# EasyEDA Pro project 射级跟随器.eprj

# Schematic Schematic1
Board Name: Board1; Create Date: 2025-05-12; Page Name: P1; Project Name: 射极跟随器; Schematic Name: Schematic1; Update Date: 2025-05-12; Company: 嘉立创EDA; Page Size: A4; Version: V1.0
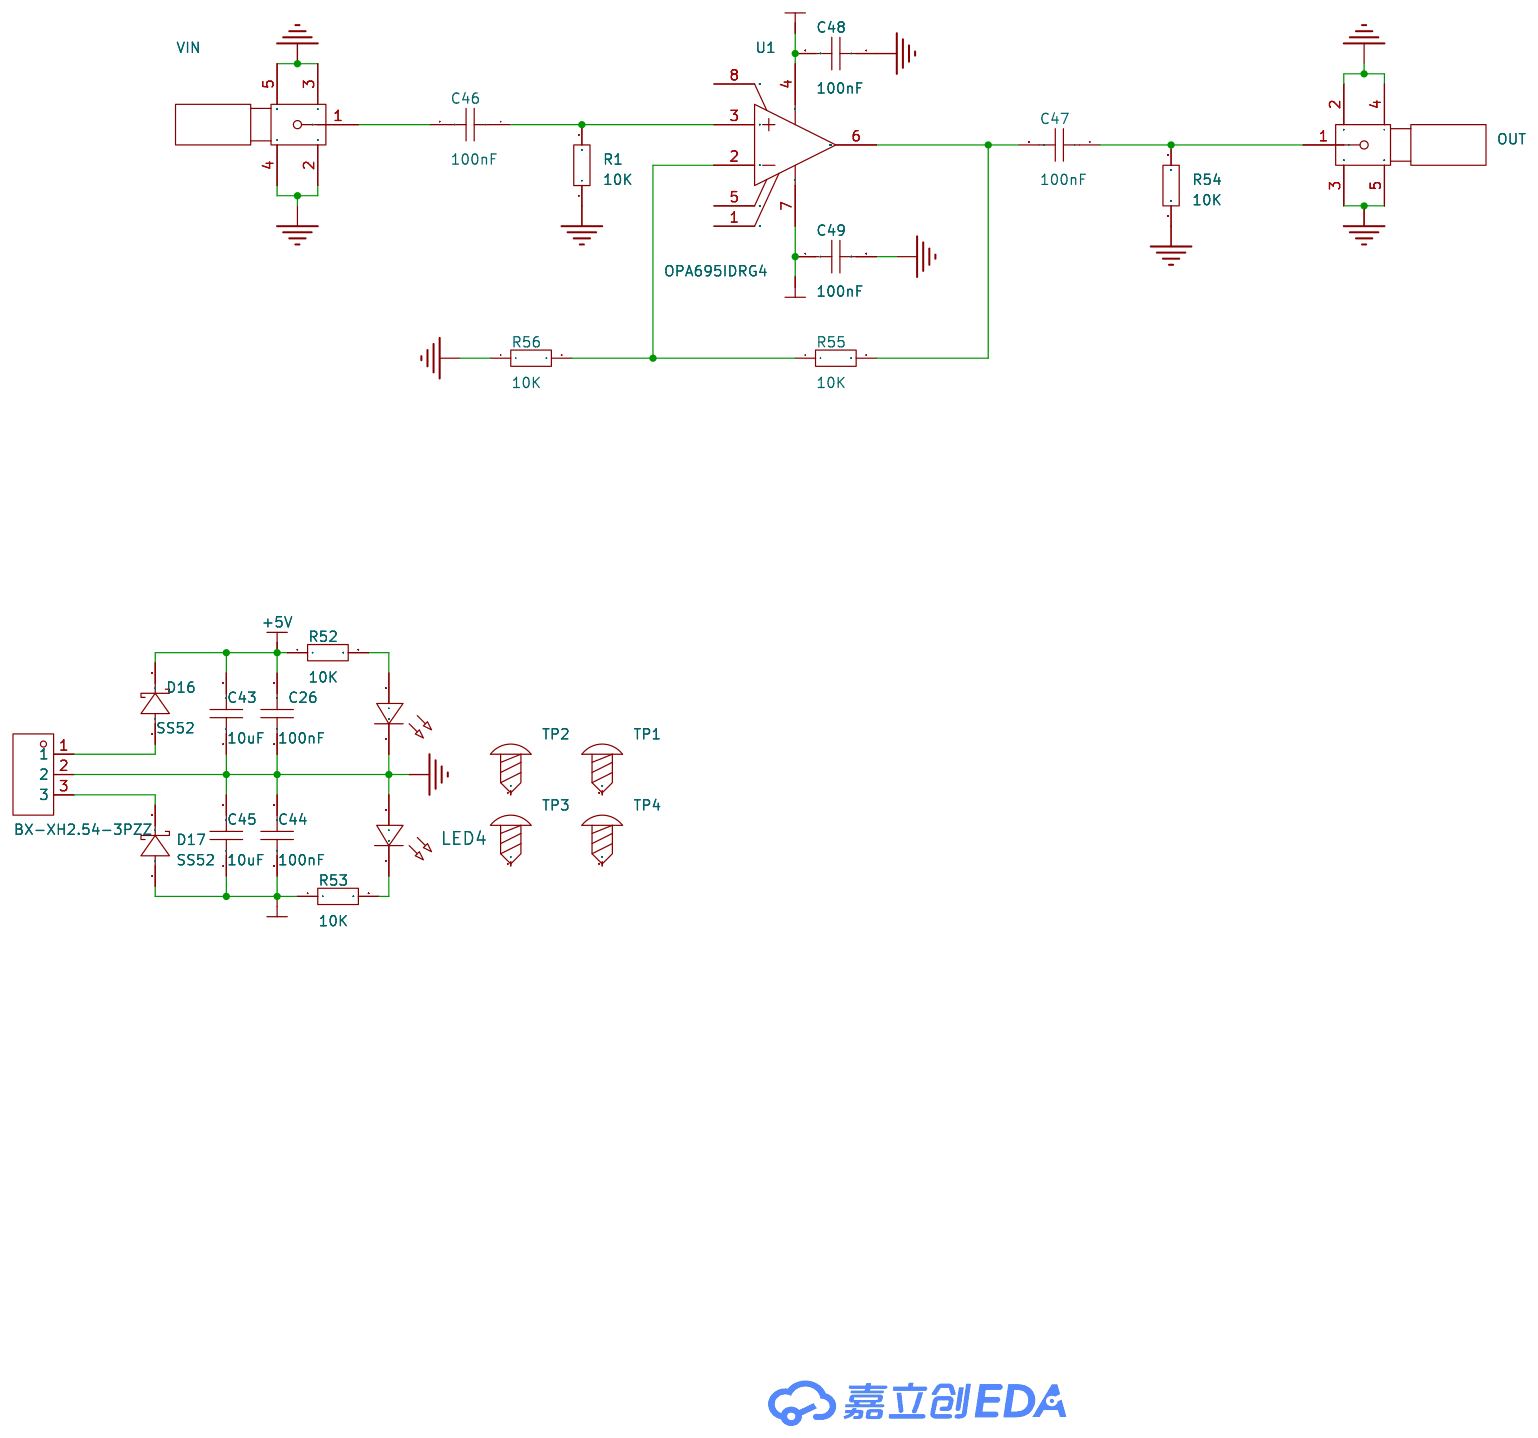
[diagram p0: schematic sheet]

## Parts
C26  100nF  [C0603]
C43  10uF  [C0603]
C44  100nF  [C0603]
C45  10uF  [C0603]
C46  100nF  [C0603]
C47  100nF  [C0603]
C48  100nF  [C0603]
C49  100nF  [C0603]
D16  SS52  [SMA_L4.3-W2.6-LS5.1-R-RD]
D17  SS52  [SMA_L4.3-W2.6-LS5.1-R-RD]
LED3  -  [LED_0603]
LED4  -  [LED_0603]
OUT  被测信号  [SMA-SMD_SMA-KE]
R1  10K  [R0603]
R52  10K  [R0603]
R53  10K  [R0603]
R54  10K  [R0603]
R55  10K  [R0603]
R56  10K  [R0603]
TP1  -  [M2螺丝]
TP2  -  [M2螺丝]
TP3  -  [M2螺丝]
TP4  -  [M2螺丝]
U1  OPA695IDRG4  [SOIC-8_L5.0-W4.0-P1.27-LS6.1-BL]
U2  BX-XH2.54-3PZZ  [CONN-TH_3P-P2.50_BX-XH2.54-3PZZ]
VIN  被测信号  [SMA-SMD_SMA-KE]

## Library data of the parts
C26 C43-C49 = CAP_0603: Supplier Footprint: 0603
D16 D17 = SS52: 二极管配置:独立式;正向压降(Vf):550mV@5A;直流反向耐压(Vr):20V;平均整流电流(Io):5A;; LCSC Part Name: 电压:20V 电流:5A; Supplier Part: C727064; Manufacturer: TWGMC(台湾迪嘉); Supplier Footprint: SMA(DO-214AC); JLCPCB Part Class: 扩展库; Datasheet: https://atta.szlcsc.com/upload/public/pdf/source/20200828/C727064_BD0A2B36CBC76CEA4B6710C57718D41F.pdf; Supplier: LCSC; Diode Configuration: 独立式; Forward Voltage (Vf@If): 550mV@5A; Reverse Voltage (Vr): 20V; Average Rectified Current (Io): 5A; Reverse Leakage Current (Ir): 500uA@20V
LED3 LED4 = LED_0603-R: Supplier Footprint: 0603
OUT VIN = SMA-KE_C9900004802: LCSC Part Name: SMA-KE; Supplier Part: C9900004802; Supplier Footprint: SMA-Hole-2Pin; JLCPCB Part Class: 扩展库; Supplier: LCSC
R1 R52-R56 = Res_0603: Supplier Footprint: 0603
TP1-TP4 = M2螺丝: Supplier Footprint: 插件
U1 = OPA695IDRG4: OPA695 具有禁用功能的超宽带电流反馈运算放大器; Supplier Part: C2059731; Manufacturer: TI(德州仪器); Supplier Footprint: SOIC-8; JLCPCB Part Class: 扩展库; Datasheet: https://www.ti.com/cn/lit/gpn/opa695; Supplier: LCSC
U2 = BX-XH2.54-3PZZ: 插针结构:1x3P;间距:2.54mm;安装方式:直插;参考系列:XH;总PIN数:3P;排数:1;每排PIN数:3;行距:-;额定电流:3A;触头材质:黄铜;触头镀层:锡;工作温度范围:-25℃~+85℃;; Supplier Part: C18077834; Manufacturer: Bossie(博锡); Supplier Footprint: 插件,P=2.54mm; JLCPCB Part Class: 扩展库; Datasheet: https://atta.szlcsc.com/upload/public/pdf/source/20231017/BF89167887E1F965B2791D14EC788A09.pdf; Supplier: LCSC; Pins Structure: 1x3P; Pitch: 2.54mm; Mounting Style: 直插; Reference Series: XH; Number of Pins: 3P; Number of Rows: 1; Number of PINs Per Row: 3; Current Rating (Max): 3A; Contact Material: 黄铜; Contact Plating: 锡; Operating Temperature Range: -25℃~+85℃

## Nets
+5V: C26.2 C43.2 C49.1 D16.2(K) R52.1 U1.7(+VS)
-5V: C44.1 C45.1 C48.2 D17.1(A) R53.1 U1.4(-VS)
GND: C26.1 C43.1 C44.2 C45.2 C48.1 C49.2 LED3.1(C) LED4.2(A) OUT.2 OUT.3 OUT.4 OUT.5 R1.1 R54.1 R56.1 U2.2 VIN.2 VIN.3 VIN.4 VIN.5
Net-(C46-1): C46.1 R1.2 U1.3(+IN)
Net-(C46-2): C46.2 VIN.1
Net-(C47-1): C47.1 OUT.1 R54.2
Net-(C47-2): C47.2 R55.2 U1.6(Output)
Net-(D16-1): D16.1(A) U2.1
Net-(D17-2): D17.2(K) U2.3
Net-(LED3-2): LED3.2(A) R52.2
Net-(LED4-1): LED4.1(C) R53.2
Net-(R55-1): R55.1 R56.2 U1.2(-IN)

Not connected (* = marked no-connect by the designer): TP1 1; TP2 1; TP3 1; TP4 1; U1 1(NC) 5(NC) 8(DIS#)
